# Altium schematic sheet VoltageSensing.SchDoc
size A4; SPICEModelCacheCLRMJWCR: <root> / <DocumentId>CLRMJWCR</DocumentId> / <CacheFrame Number="0"> / <Model Name="tmk107b7105_a-t" Kind="CKT"> / <Text>* TMK107B7105_A-T     SPICE MODEL  ( General Type ) / *-------------------------------------------------------------------------------------------------------- / * Model Generated by TAIYO YUDEN Corporation (http://www.ty-top.com) / * Version 1.0 / * TAIYO YUDEN Control No. 170508_100817 / * Copyright(c) 2012 TAIYO YUDEN CO.,LTD. All Rights Reserved. / *-------------------------------------------------------------------------------------------------------- / * / * Products Name : Multilayer Ceramic Capacitors / * / * Characteristics : / *     Capacitance : 1 uF , Rated Voltage : 25V , TCC : X7R / *     Case Size : 1.6 x 0.8 / 0.063 x 0.031 [mm/inch] , Thickness : 0.8 / 0.031 [mm/inch] / *     (Conditions: Temperature = 25 degC , DC Bias Current/Voltage = 0A / 0V) / * / * Frequency Range : 40Hz - 3GHz / * / * External Node Assignments : / * / *  1  o---| |---o  2 / * / *-------------------------------------------------------------------------------------------------------- / .SubCkt TMK107B7105_A-T 1 2 / **************************** / C0 1 110 0.8077u / Cm 1 101 0.091409u / C1 101 102 0.22841u / Rc1 101 102 2.6849k / C2 102 103 0.056864u / Rc2 102 103 354.66 / C3 103 110 0.05273u / Rc3 103 110 25.631 / C2m 1 301 0.15309u / C21 301 302 0.37938u / Rc21 301 302 9.5172k / C22 302 303 0.45808u / Rc22 302 303 6.9429k / C23 303 304 0.40786u / Rc23 303 304 2.3301k / C24 304 305 0.15311u / Rc24 304 305 806.02 / C25 305 306 0.22413u / Rc25 305 306 462.56 / C26 306 307 0.18632u / Rc26 306 307 35.279 / C27 307 308 0.15722u / Rc27 307 308 39.531 / C28 308 309 0.078196u / Rc28 308 309 48.947 / C29 309 110 6560.8p / Rc29 309 110 9.5708 / Rp0 1 110 100Meg / L0 110 120 0.29644n / Lm 120 130 0.15558n / L1 120 121 0.202n / RL1 121 130 0.16398 / L2 120 122 0.33479n / RL2 122 130 0.31977 / L3 120 123 0.92343n / RL3 123 130 0.85069 / CR 120 124 0.21801u / LR 124 125 0.13885n / RR 125 130 35.905m / CL 130 140 1.934p / LL 130 140 0.19618n / RL 130 140 45.012 / Rs 140 2 6.428m / **************************** / .ends TMK107B7105_A-T</Text> / </Model> / </CacheFrame> / </root>; SheetNumber: 5; SheetTotal: 9
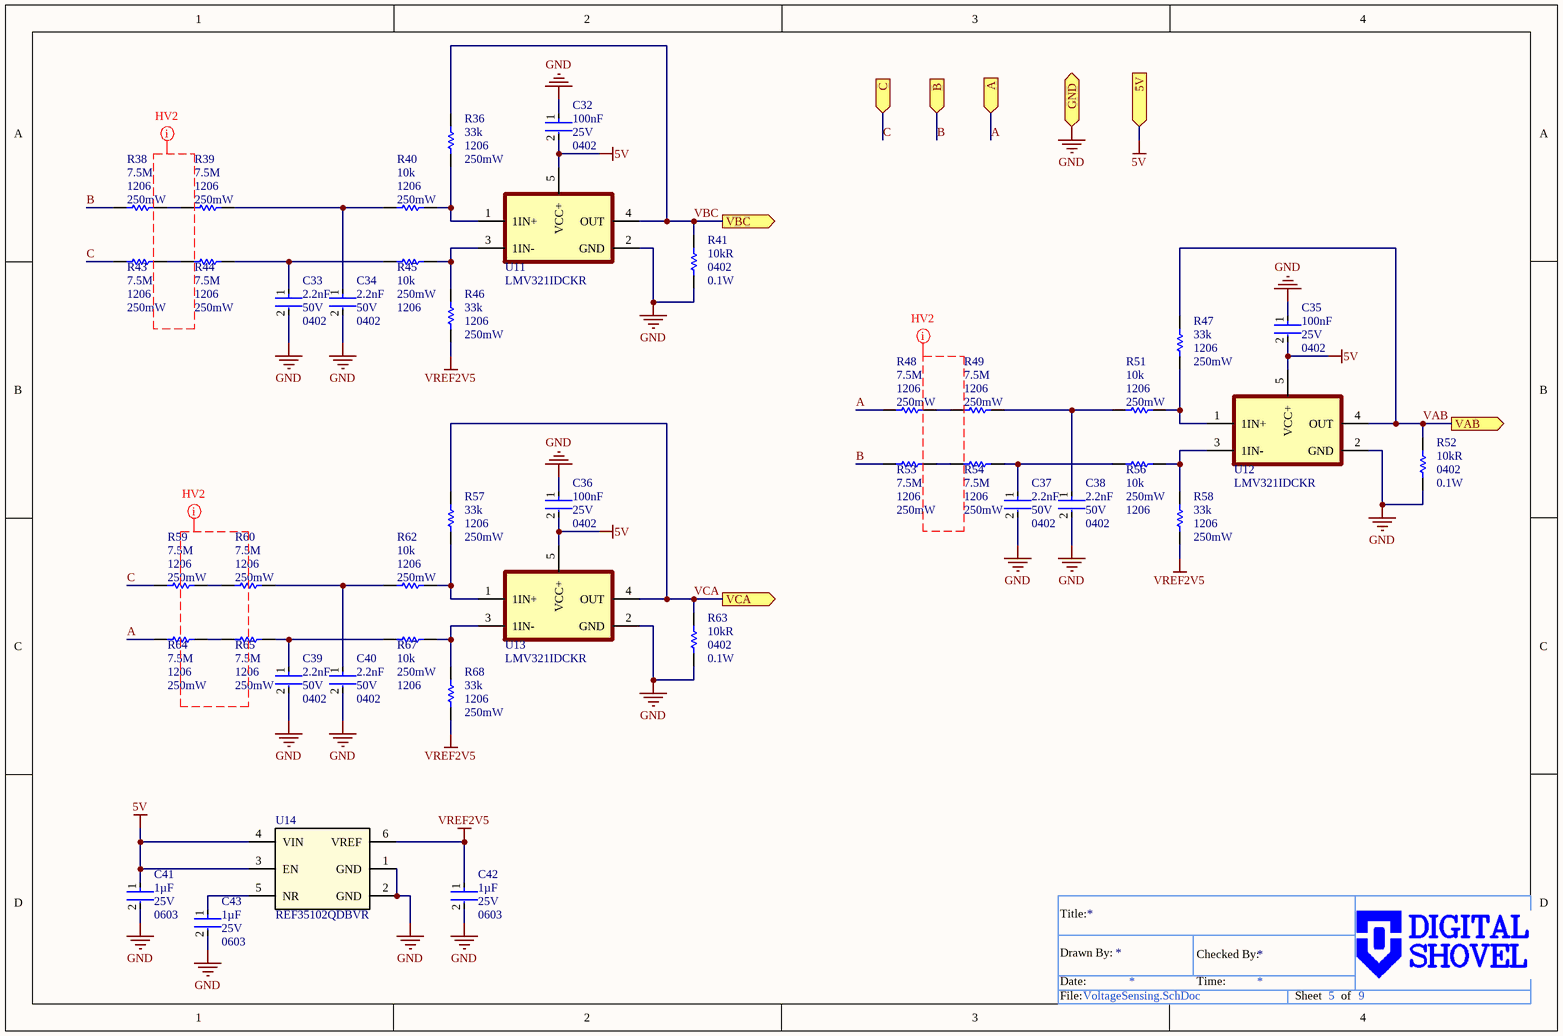
[diagram p0: VoltageSensing.SchDoc]

## Parts
C32  value 100nF  Voltage Rating: 25V  Case/Package: 0402  [FP-CL830-IPC_A]  (hidden comment: CL05B104KA5NNNC)
C33  value 2.2nF  Voltage Rating: 50V  Case/Package: 0402  [FP-C0402-BB-IPC_A]  (hidden comment: C0402C222J5RACTU)
C34  value 2.2nF  Voltage Rating: 50V  Case/Package: 0402  [FP-C0402-BB-IPC_A]  (hidden comment: C0402C222J5RACTU)
C35  value 100nF  Voltage Rating: 25V  Case/Package: 0402  [FP-CL830-IPC_A]  (hidden comment: CL05B104KA5NNNC)
C36  value 100nF  Voltage Rating: 25V  Case/Package: 0402  [FP-CL830-IPC_A]  (hidden comment: CL05B104KA5NNNC)
C37  value 2.2nF  Voltage Rating: 50V  Case/Package: 0402  [FP-C0402-BB-IPC_A]  (hidden comment: C0402C222J5RACTU)
C38  value 2.2nF  Voltage Rating: 50V  Case/Package: 0402  [FP-C0402-BB-IPC_A]  (hidden comment: C0402C222J5RACTU)
C39  value 2.2nF  Voltage Rating: 50V  Case/Package: 0402  [FP-C0402-BB-IPC_A]  (hidden comment: C0402C222J5RACTU)
C40  value 2.2nF  Voltage Rating: 50V  Case/Package: 0402  [FP-C0402-BB-IPC_A]  (hidden comment: C0402C222J5RACTU)
C41  value 1µF  Voltage Rating: 25V  Case/Package: 0603  [FP-0603-L_1_6_0_1-W_0_8_0-IPC_A]  (hidden comment: TMK107B7105KA-T)
C42  value 1µF  Voltage Rating: 25V  Case/Package: 0603  [FP-0603-L_1_6_0_1-W_0_8_0-IPC_A]  (hidden comment: TMK107B7105KA-T)
C43  value 1µF  Voltage Rating: 25V  Case/Package: 0603  [FP-0603-L_1_6_0_1-W_0_8_0-IPC_A]  (hidden comment: TMK107B7105KA-T)
R36  value 33k  Power: 250mW  Case/Package: 1206  [RESC3216X70X40NL20T20]  (hidden comment: RK73H2BTTD3302F)
R38  value 7.5M  Case/Package: 1206  Power: 250mW  [FP-KTR18-IPC_A]  (hidden comment: KTR18EZPF7504)
R39  value 7.5M  Case/Package: 1206  Power: 250mW  [FP-KTR18-IPC_A]  (hidden comment: KTR18EZPF7504)
R40  value 10k  Power: 250mW  Case/Package: 1206  [RESC3216X70X40NL20T20]  (hidden comment: RK73H2BTTD1002F)
R41  value 10kR  Package: 0402  Power: 0.1W  [RESC1005X40X25LL10T10]  (hidden comment: RK73H1ETTP1002F)
R43  value 7.5M  Case/Package: 1206  Power: 250mW  [FP-KTR18-IPC_A]  (hidden comment: KTR18EZPF7504)
R44  value 7.5M  Case/Package: 1206  Power: 250mW  [FP-KTR18-IPC_A]  (hidden comment: KTR18EZPF7504)
R45  value 10k  Power: 250mW  Case/Package: 1206  [RESC3216X70X40NL20T20]  (hidden comment: RK73H2BTTD1002F)
R46  value 33k  Power: 250mW  Case/Package: 1206  [RESC3216X70X40NL20T20]  (hidden comment: RK73H2BTTD3302F)
R47  value 33k  Power: 250mW  Case/Package: 1206  [RESC3216X70X40NL20T20]  (hidden comment: RK73H2BTTD3302F)
R48  value 7.5M  Case/Package: 1206  Power: 250mW  [FP-KTR18-IPC_A]  (hidden comment: KTR18EZPF7504)
R49  value 7.5M  Case/Package: 1206  Power: 250mW  [FP-KTR18-IPC_A]  (hidden comment: KTR18EZPF7504)
R51  value 10k  Power: 250mW  Case/Package: 1206  [RESC3216X70X40NL20T20]  (hidden comment: RK73H2BTTD1002F)
R52  value 10kR  Package: 0402  Power: 0.1W  [RESC1005X40X25LL10T10]  (hidden comment: RK73H1ETTP1002F)
R53  value 7.5M  Case/Package: 1206  Power: 250mW  [FP-KTR18-IPC_A]  (hidden comment: KTR18EZPF7504)
R54  value 7.5M  Case/Package: 1206  Power: 250mW  [FP-KTR18-IPC_A]  (hidden comment: KTR18EZPF7504)
R56  value 10k  Power: 250mW  Case/Package: 1206  [RESC3216X70X40NL20T20]  (hidden comment: RK73H2BTTD1002F)
R57  value 33k  Power: 250mW  Case/Package: 1206  [RESC3216X70X40NL20T20]  (hidden comment: RK73H2BTTD3302F)
R58  value 33k  Power: 250mW  Case/Package: 1206  [RESC3216X70X40NL20T20]  (hidden comment: RK73H2BTTD3302F)
R59  value 7.5M  Case/Package: 1206  Power: 250mW  [FP-KTR18-IPC_A]  (hidden comment: KTR18EZPF7504)
R60  value 7.5M  Case/Package: 1206  Power: 250mW  [FP-KTR18-IPC_A]  (hidden comment: KTR18EZPF7504)
R62  value 10k  Power: 250mW  Case/Package: 1206  [RESC3216X70X40NL20T20]  (hidden comment: RK73H2BTTD1002F)
R63  value 10kR  Package: 0402  Power: 0.1W  [RESC1005X40X25LL10T10]  (hidden comment: RK73H1ETTP1002F)
R64  value 7.5M  Case/Package: 1206  Power: 250mW  [FP-KTR18-IPC_A]  (hidden comment: KTR18EZPF7504)
R65  value 7.5M  Case/Package: 1206  Power: 250mW  [FP-KTR18-IPC_A]  (hidden comment: KTR18EZPF7504)
R67  value 10k  Power: 250mW  Case/Package: 1206  [RESC3216X70X40NL20T20]  (hidden comment: RK73H2BTTD1002F)
R68  value 33k  Power: 250mW  Case/Package: 1206  [RESC3216X70X40NL20T20]  (hidden comment: RK73H2BTTD3302F)
U11  LMV321IDCKR  [LMV321IDCKR-Footprint-1]
U12  LMV321IDCKR  [LMV321IDCKR-Footprint-1]
U13  LMV321IDCKR  [LMV321IDCKR-Footprint-1]
U14  REF35102QDBVR  [REF35102QDBVR-Footprint-1]

## Ports
5V (in), A (in), B (in), C (in), GND (bidir), VAB (out), VBC (out), VCA (out)

## Nets
5V: C32.2 C35.2 C36.2 C41.1 U11.5(VCC+) U12.5(VCC+) U13.5(VCC+) U14.3(EN) U14.4(VIN) ; port 5V
GND: C32.1 C33.2 C34.2 C35.1 C36.1 C37.2 C38.2 C39.2 C40.2 C41.2 C42.2 C43.2 R41.2 R52.2 R63.2 U11.2(GND) U12.2(GND) U13.2(GND) U14.1(GND) U14.2(GND) ; port GND
VREF2V5: C42.1 R46.1 R58.1 R68.1 U14.6(VREF)
A: R48.2 R64.2 ; port A
B: R38.2 R53.2 ; port B
C: R43.2 R59.2 ; port C
VAB: R47.2 R52.1 U12.4(OUT) ; port VAB
VBC: R36.2 R41.1 U11.4(OUT) ; port VBC
VCA: R57.2 R63.1 U13.4(OUT) ; port VCA
NetC33_1: C33.1 R44.1 R45.1
NetC34_1: C34.1 R39.1 R40.1
NetC37_1: C37.1 R54.1 R56.1
NetC38_1: C38.1 R49.1 R51.1
NetC39_1: C39.1 R65.1 R67.1
NetC40_1: C40.1 R60.1 R62.1
NetC43_1: C43.1 U14.5(NR)
NetR36_1: R36.1 R40.2 U11.1(1IN+)
NetR38_1: R38.1 R39.2
NetR43_1: R43.1 R44.2
NetR45_2: R45.2 R46.2 U11.3(1IN-)
NetR47_1: R47.1 R51.2 U12.1(1IN+)
NetR48_1: R48.1 R49.2
NetR53_1: R53.1 R54.2
NetR56_2: R56.2 R58.2 U12.3(1IN-)
NetR57_1: R57.1 R62.2 U13.1(1IN+)
NetR59_1: R59.1 R60.2
NetR64_1: R64.1 R65.2
NetR67_2: R67.2 R68.2 U13.3(1IN-)

## Layout directives
net class HV2: (no net found under the mark)

## Notes on the sheet
- Title:
- Date:
- Drawn By:
- Time:
- Checked By:
- File:
- Sheet
- of

## Library data of the parts
C32 C35 C36 = CMP-001-00333-1: Ceramic Capacitor, Multilayer, Ceramic, 25V, 10% +Tol, 10% -Tol, X7R, 15% TC, 0.1uF, Surface Mount, 0402; Max Operating Temperature: 125°C; RoHS Compliant: Yes; Capacitor Type: Ceramic; Min Operating Temperature: -55°C; Pins: 2; Mounting Technology: Surface Mount
C33 C34 C37-C40 = CMP-001-00335-1: Ceramic Capacitor, Multilayer, Ceramic, 50V, 5% +Tol, 5% -Tol, X7R, 15% TC, 0.0022uF, Surface Mount, 0402; Pins: 2; RoHS Compliant: Yes; Mounting Technology: Surface Mount; Max Operating Temperature: 125°C; Capacitor Type: Ceramic; Min Operating Temperature: -55°C
C41-C43 = CMP-001-00326-1: Ceramic Capacitor, Multilayer, Ceramic, 25V, 10% +Tol, 10% -Tol, X7R, 15% TC, 1uF, Surface Mount, 0603; Pins: 2; Capacitor Type: Ceramic; Min Operating Temperature: -55°C; Max Operating Temperature: 125°C; RoHS Compliant: Yes; Mounting Technology: Surface Mount
R36 R46 R47 R57 R58 R68 = CMP-009-01018-1: Fixed Resistor, Metal Glaze/thick Film, 0.25W, 33000ohm, 200V, 1% +/-Tol, 100ppm/Cel, Surface Mount, 1206; Pins: 2; Max Operating Temperature: 155°C; Tolerance: 1%; Min Operating Temperature: -55°C; Mounting Technology: Surface Mount; RoHS Compliant: Yes
R38 R39 R43 R44 R48 R49 R53 R54 R59 R60 R64 R65 = CMP-009-01037-1: Fixed Resistor, 0.25W, 7500000ohm, 500V, 1% +/-Tol, 100ppm/Cel, Surface Mount, 1206; Voltage Rating: 500V; Min Operating Temperature: -55°C; Max Operating Temperature: 155°C; RoHS Compliant: Yes; Pins: 2; Mounting Technology: Surface Mount; Tolerance: 1%
R40 R45 R51 R56 R62 R67 = CMP-009-00976-1: Fixed Resistor, Metal Glaze/thick Film, 0.25W, 10000ohm, 200V, 1% +/-Tol, 100ppm/Cel, Surface Mount, 1206; RoHS Compliant: Yes; Pins: 2; Mounting Technology: Surface Mount; Tolerance: 1%; Max Operating Temperature: 155°C; Min Operating Temperature: -55°C
R41 R52 R63 = CMP-x00150-2: Fixed Resistor, Metal Glaze/thick Film, 0.1W, 10000ohm, 75V, 1% +/-Tol, 100ppm/Cel, Surface Mount, 0402; Template: KS_0402_R
U11-U13 = CMP-014-00033-1: Operational Amplifier, 1 Func, 7000uV Offset-Max, BIPolar, PDSO5; Channels: 1; Nominal Supply Voltage: 2.7V; Pins: 5; RoHS Compliant: Yes; Min Operating Temperature: -40°C; Case/Package: TSSOP; Max Operating Temperature: 125°C
U14 = CMP-031-00033-1: 650-nA quiescent current, 12-ppm/°C drift, ultra-low-power precision voltage reference 6-SOT-23 -40 to 125